# Altium schematic sheet 1.5KW总控制板新.SchDoc
size A2; PageSetup: Record=PageOptions|CenterHorizontal=True|CenterVertical=True|PrintScale=0.50|XCorrection=1.00|YCorrection=1.00|PrintKind=1|BorderSize=5000000|LeftOffset=0|BottomOffset=0|Orientation=2|PaperLength=1000|PaperWidth=1000|Scale=100|PaperSource=15|PrintQuality=600|MediaType=1|DitherType=10|PaperKind=A3|PrintScaleMode=1
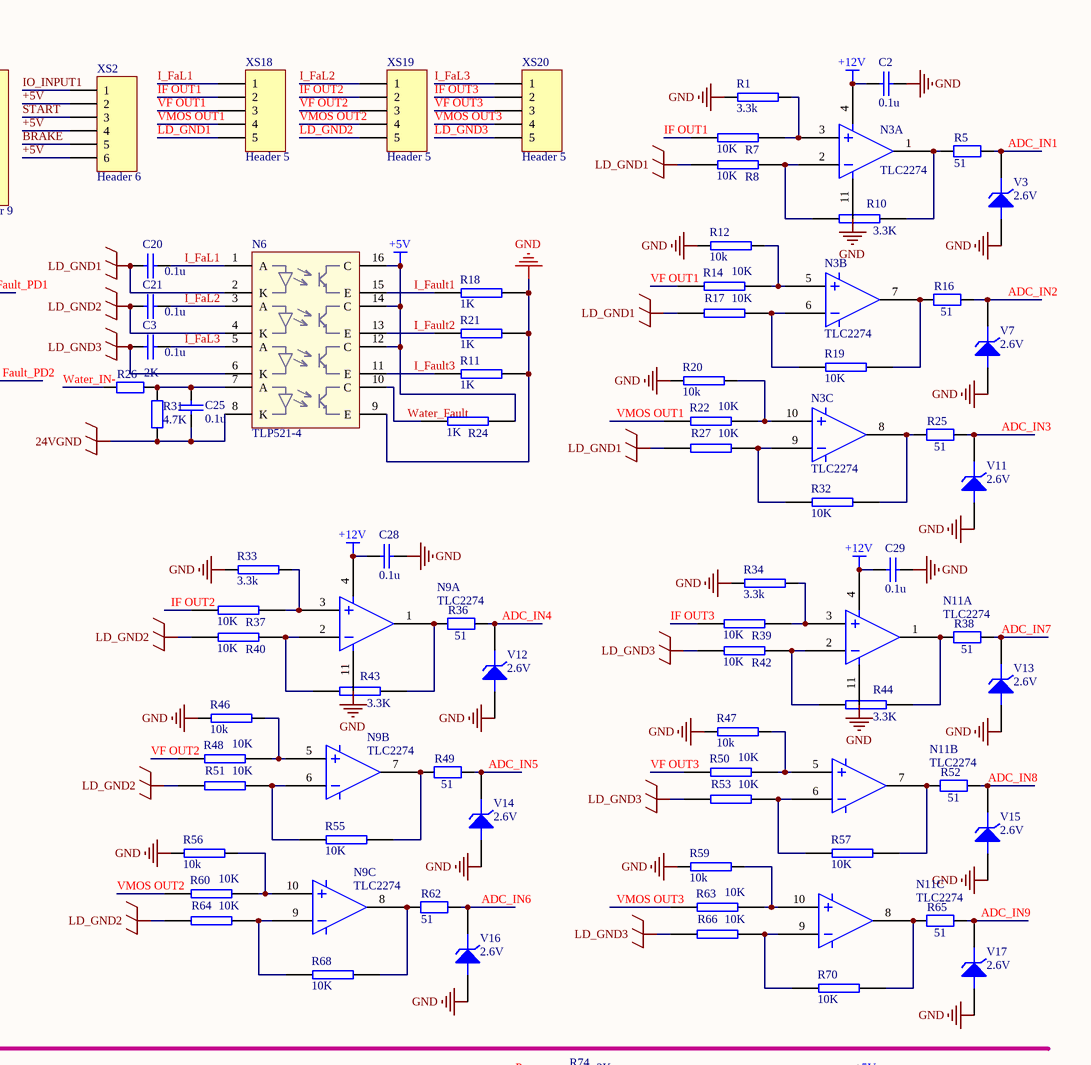
[diagram p0: 1.5KW总控制板新.SchDoc, top right]
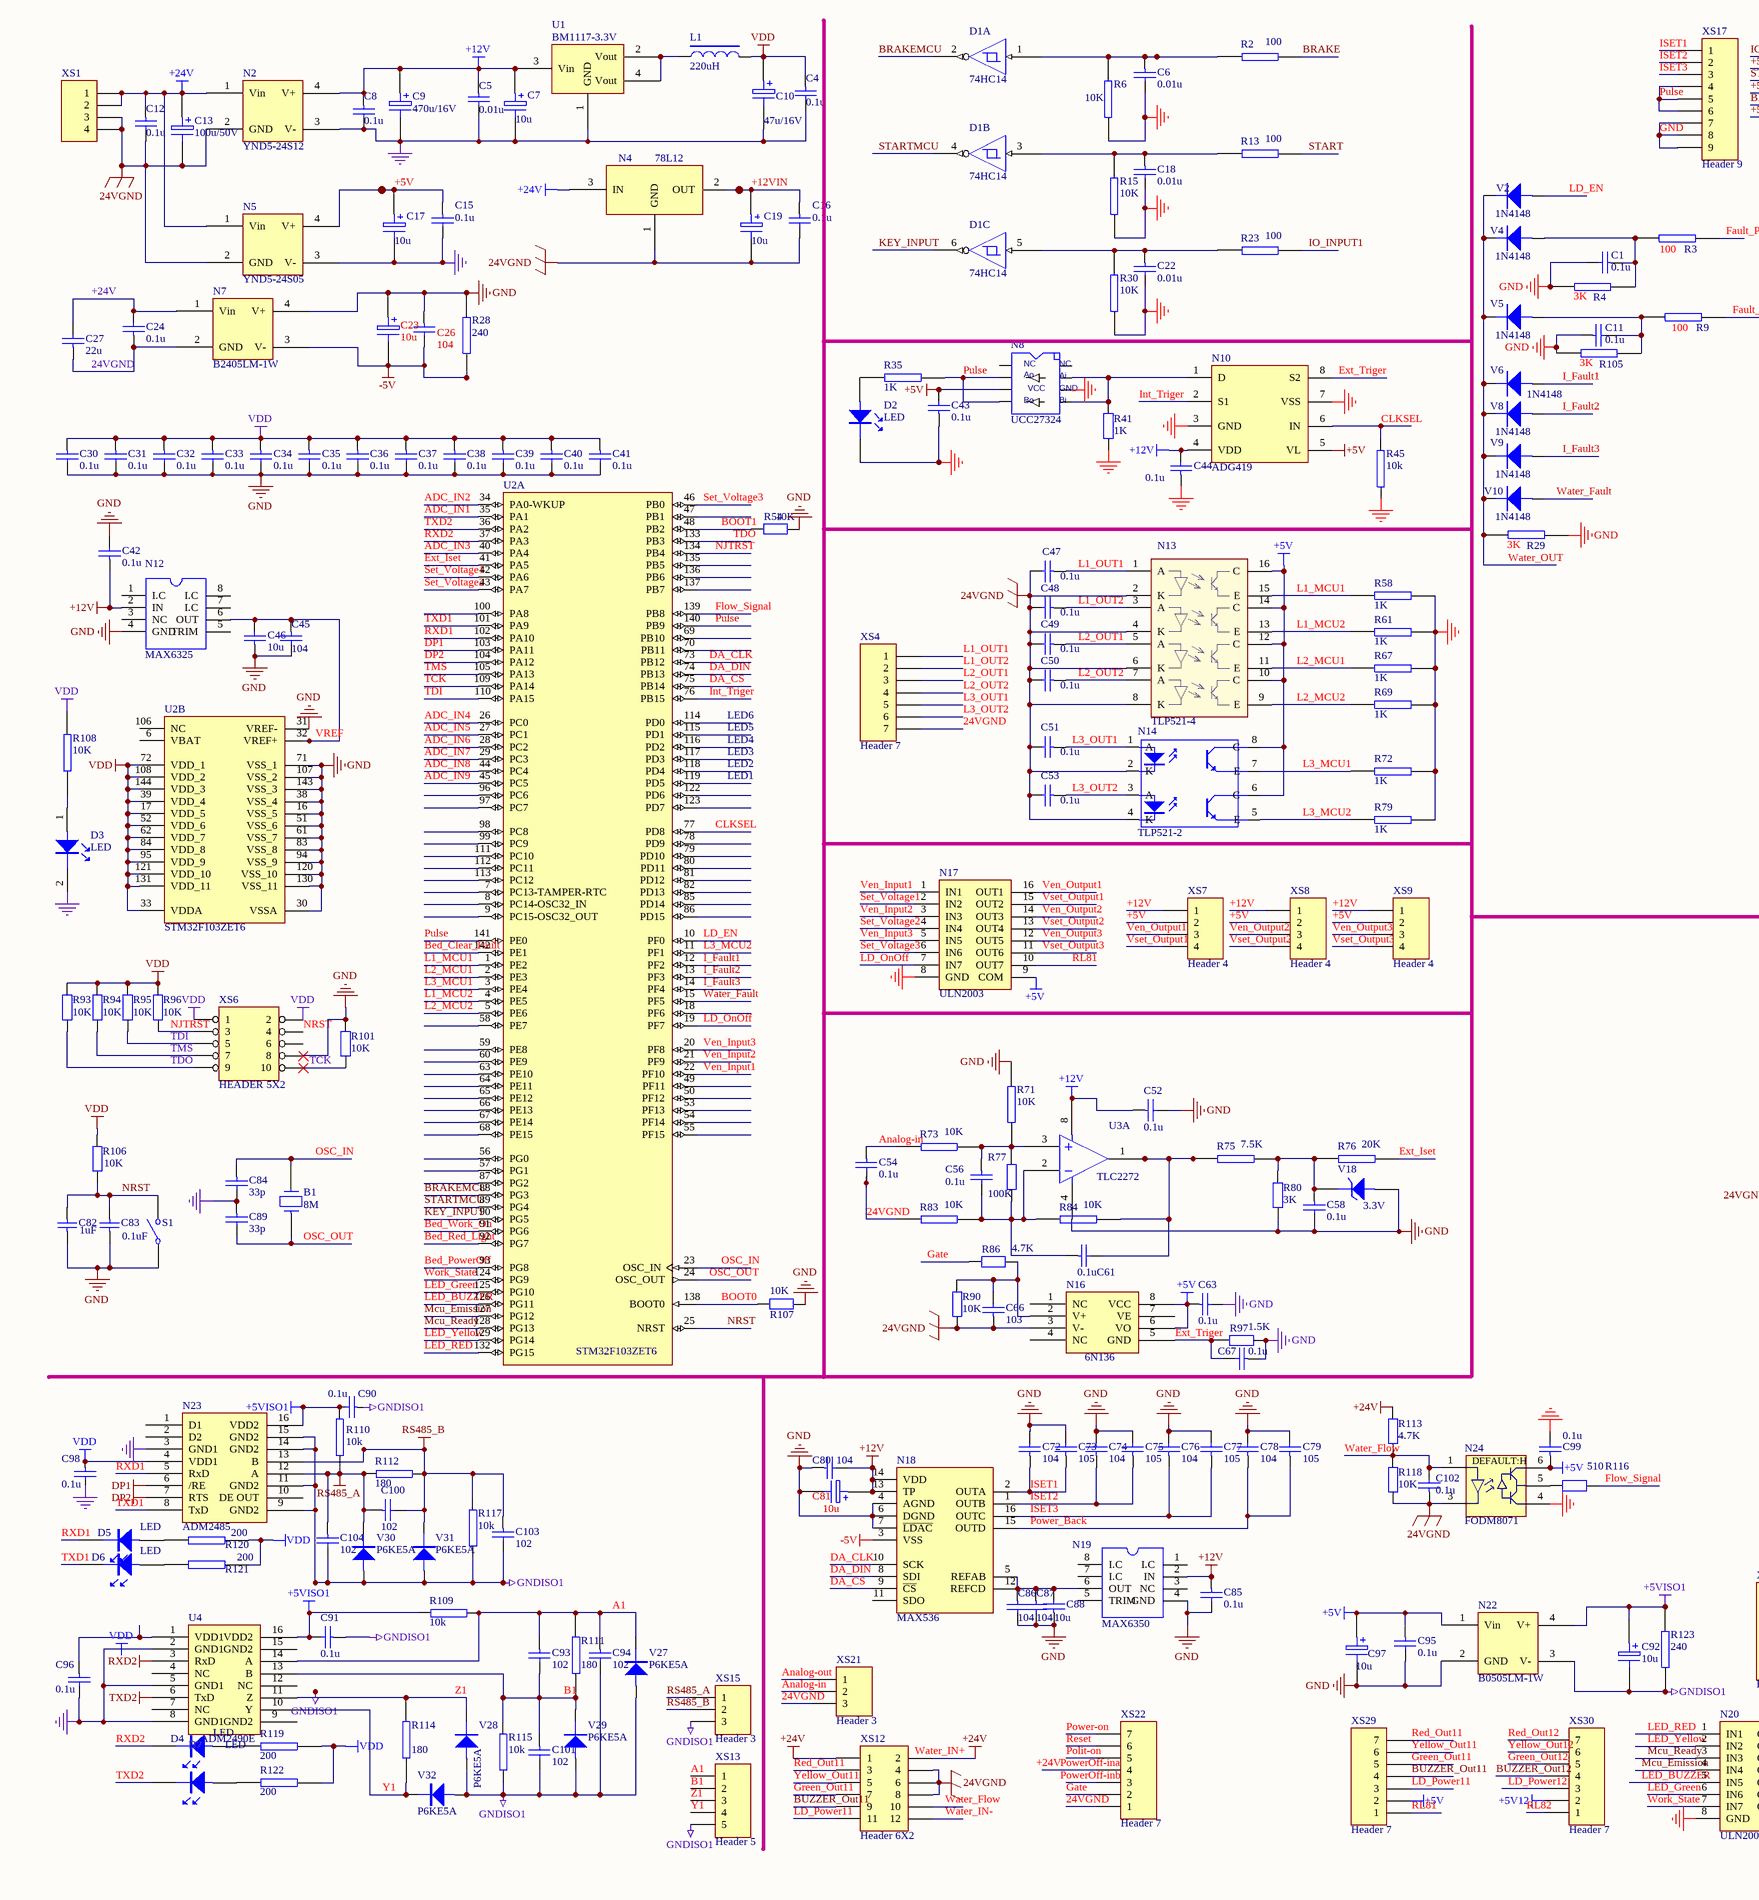
[diagram p1: 1.5KW总控制板新.SchDoc, bottom left]
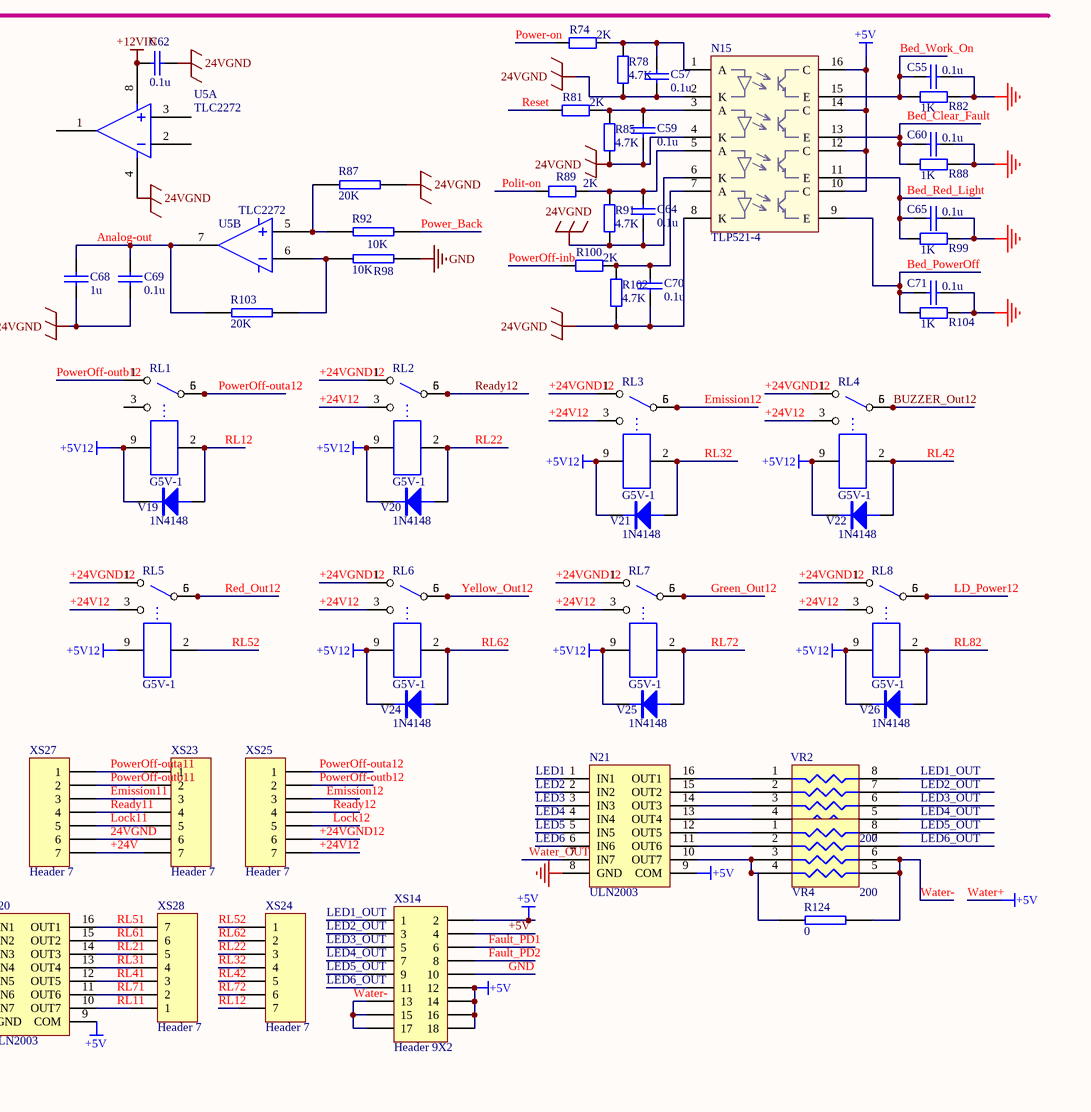
[diagram p2: 1.5KW总控制板新.SchDoc, bottom right]

## Parts
B1  8M  [CRY_SMB]
C1  0.1u  [0805]
C2  0.1u  [0805]
C3  0.1u  [0805]
C4  0.1u  [0805]
C5  0.01u  [0805]
C6  0.01u  [0805]
C7  10u  [1206]
C8  0.1u  [0805]
C9  470u/16V  [3008]
C10  47u/16V  [1206]
C11  0.1u  [0805]
C12  0.1u  [0805]
C13  100u/50V  [CD5-8]
C15  0.1u  [0805]
C16  0.1u  [0805]
C17  10u  [1206]
C18  0.01u  [0805]
C19  10u  [1206]
C20  0.1u  [0805]
C21  0.1u  [0805]
C22  0.01u  [0805]
C23  10u  [1206]
C24  0.1u  [0805]
C25  0.1u  [0805]
C26  104  [0805]
C27  22u  [1206]
C28  0.1u  [0805]
C29  0.1u  [0805]
C30  0.1u  [0805]
C31  0.1u  [0805]
C32  0.1u  [0805]
C33  0.1u  [0805]
C34  0.1u  [0805]
C35  0.1u  [0805]
C36  0.1u  [0805]
C37  0.1u  [0805]
C38  0.1u  [0805]
C39  0.1u  [0805]
C40  0.1u  [0805]
C41  0.1u  [0805]
C42  0.1u  [0805]
C43  0.1u  [0805]
C44  0.1u  [0805]
C45  104  [0805]
C46  10u  [0805]
C47  0.1u  [0805]
C48  0.1u  [0805]
C49  0.1u  [0805]
C50  0.1u  [0805]
C51  0.1u  [0805]
C52  0.1u  [0805]
C53  0.1u  [0805]
C54  0.1u  [0805]
C55  0.1u  [0805]
C56  0.1u  [0805]
C57  0.1u  [0805]
C58  0.1u  [0805]
C59  0.1u  [0805]
C60  0.1u  [0805]
C61  0.1u  [0805]
C62  0.1u  [0805]
C63  0.1u  [0805]
C64  0.1u  [0805]
C65  0.1u  [0805]
C66  103  [0805]
C67  0.1u  [0805]
C68  1u  [0805]
C69  0.1u  [0805]
C70  0.1u  [0805]
C71  0.1u  [0805]
C72  104  [0805]
C73  105  [0805]
C74  104  [0805]
C75  105  [0805]
C76  104  [0805]
C77  105  [0805]
C78  104  [0805]
C79  105  [0805]
C80  104  [0805]
C81  10u  [1206]
C82  1uF  [0805]
C83  0.1uF  [0805]
C84  33p  [0805]
C85  0.1u  [0805]
C86  104  [0805]
C87  104  [0805]
C88  10u  [0805]
C89  33p  [0805]
C90  0.1u  [0805]
C91  0.1u  [0805]
C92  10u  [1206]
C93  102  [0805]
C94  102  [0805]
C95  0.1u  [0805]
C96  0.1u  [0805]
C97  10u  [1206]
C98  0.1u  [0805]
C99  0.1u  [0805]
C100  102  [0805]
C101  102  [0805]
C102  0.1u  [0805]
C103  102  [0805]
C104  102  [0805]
D1  74HC14  [SO-14]  (parts A,B,C of 6)
D2  LED  [1206A]
D3  LED  [1206A]
D4  LED  [1206A]
D5  LED  [1206A]
D6  LED  [1206A]
D7  LED  [1206A]
L1  220uH  [1812]
N2  YND5-24S12  [YND5]
N3  TLC2274  [SO-14]  (parts A,B,C of 4)
N4  78L12  [TO-92_2]
N5  YND5-24S05  [YND5]
N6  TLP521-4  [ILEAD-16]
N7  B2405LM-1W  [B0505LM]
N8  UCC27324  [SO-8]
N9  TLC2274  [SO-14]  (parts A,B,C of 4)
N10  ADG419  [SO-8]
N11  TLC2274  [SO-14]  (parts A,B,C of 4)
N12  MAX6325  [SO-8]
N13  TLP521-4  [ILEAD-16]
N14  TLP521-2  [ILEAD-8]
N15  TLP521-4  [ILEAD-16]
N16  6N136  [ILEAD-8]
N17  ULN2003  [SOIC127P600-16N]
N18  MAX536  [SOIC-16]
N19  MAX6350  [SO-8]
N20  ULN2003  [SOIC127P600-16N]
N21  ULN2003  [SOIC127P600-16N]
N22  B0505LM-1W  [B0505LM]
N23  ADM2485  [SOIC-16]
N24  FODM8071  [SOP5]
R1  3.3k  [0805]
R2  100  [0805]
R3  100  [0805]
R4  3K  [0805]
R5  51  [0805]
R6  10K  [0805]
R7  10K  [0805]
R8  10K  [0805]
R9  100  [0805]
R10  3.3K  [0805]
R11  1K  [0805]
R12  10k  [0805]
R13  100  [0805]
R14  10K  [0805]
R15  10K  [0805]
R16  51  [0805]
R17  10K  [0805]
R18  1K  [0805]
R19  10K  [0805]
R20  10k  [0805]
R21  1K  [0805]
R22  10K  [0805]
R23  100  [0805]
R24  1K  [0805]
R25  51  [0805]
R26  2K  [0805]
R27  10K  [0805]
R28  240  [1206]
R29  3K  [0805]
R30  10K  [0805]
R31  4.7K  [0805]
R32  10K  [0805]
R33  3.3k  [0805]
R34  3.3k  [0805]
R35  1K  [0805]
R36  51  [0805]
R37  10K  [0805]
R38  51  [0805]
R39  10K  [0805]
R40  10K  [0805]
R41  1K  [0805]
R42  10K  [0805]
R43  3.3K  [0805]
R44  3.3K  [0805]
R45  10k  [0805]
R46  10k  [0805]
R47  10k  [0805]
R48  10K  [0805]
R49  51  [0805]
R50  10K  [0805]
R51  10K  [0805]
R52  51  [0805]
R53  10K  [0805]
R54  10K  [0805]
R55  10K  [0805]
R56  10k  [0805]
R57  10K  [0805]
R58  1K  [0805]
R59  10k  [0805]
R60  10K  [0805]
R61  1K  [0805]
R62  51  [0805]
R63  10K  [0805]
R64  10K  [0805]
R65  51  [0805]
R66  10K  [0805]
R67  1K  [0805]
R68  10K  [0805]
R69  1K  [0805]
R70  10K  [0805]
R71  10K  [0805]
R72  1K  [0805]
R73  10K  [0805]
R74  2K  [0805]
R75  7.5K  [0805]
R76  20K  [0805]
R77  100K  [0805]
R78  4.7K  [0805]
R79  1K  [0805]
R80  3K  [0805]
R81  2K  [0805]
R82  1K  [0805]
R83  10K  [0805]
R84  10K  [0805]
R85  4.7K  [0805]
R86  4.7K  [1206]
R87  20K  [0805]
R88  1K  [0805]
R89  2K  [0805]
R90  10K  [0805]
R91  4.7K  [0805]
R92  10K  [0805]
R93  10K  [0805]
R94  10K  [0805]
R95  10K  [0805]
R96  10K  [0805]
R97  1.5K  [0805]
R98  10K  [0805]
R99  1K  [0805]
R100  2K  [0805]
R101  10K  [0805]
R102  4.7K  [0805]
R103  20K  [0805]
R104  1K  [0805]
R105  3K  [0805]
R106  10K  [0805]
R107  10K  [0805]
R108  10K  [0805]
R109  10k  [0805]
R110  10k  [0805]
R111  180  [1206]
R112  180  [1206]
R113  4.7K  [0805]
R114  180  [1206]
R115  10k  [0805]
R116  510  [0805]
R117  10k  [0805]
R118  10K  [0805]
R119  200  [0805]
R120  200  [0805]
R121  200  [0805]
R122  200  [0805]
R123  240  [1206]
R124  0  [0805]
RL1  G5V-1  [G5V-1]
RL2  G5V-1  [G5V-1]
RL3  G5V-1  [G5V-1]
RL4  G5V-1  [G5V-1]
RL5  G5V-1  [G5V-1]
RL6  G5V-1  [G5V-1]
RL7  G5V-1  [G5V-1]
RL8  G5V-1  [G5V-1]
S1  SW-SPST  [KEY_3*6*2.5]  (value not drawn)
U1  BM1117-3.3V  [SOT-223]
U2  STM32F103ZET6  [LQFP144_N]  (parts A,B of 2)
U3  TLC2272  [SO-8]  (part A of 2)
U4  ADM2490E  [SOIC-16]
U5  TLC2272  [SO-8]  (parts A,B of 2)
V2  1N4148  [1206A]
V3  2.6V  [1206A]
V4  1N4148  [1206A]
V5  1N4148  [1206A]
V6  1N4148  [1206A]
V7  2.6V  [1206A]
V8  1N4148  [1206A]
V9  1N4148  [1206A]
V10  1N4148  [1206A]
V11  2.6V  [1206A]
V12  2.6V  [1206A]
V13  2.6V  [1206A]
V14  2.6V  [1206A]
V15  2.6V  [1206A]
V16  2.6V  [1206A]
V17  2.6V  [1206A]
V18  3.3V  [1206A]
V19  1N4148  [1206A]
V20  1N4148  [1206A]
V21  1N4148  [1206A]
V22  1N4148  [1206A]
V24  1N4148  [1206A]
V25  1N4148  [1206A]
V26  1N4148  [1206A]
V27  P6KE5A  [1206-D]
V28  P6KE5A  [1206-D]
V29  P6KE5A  [1206-D]
V30  P6KE5A  [1206-D]
V31  P6KE5A  [1206-D]
V32  P6KE5A  [1206-D]
VR2  200  [MINZIP]
VR4  200  [MINZIP]
XS1  Header 4  [SIP-4]  (value not drawn)
XS2  Header 6  [SIP-6]
XS4  Header 7  [SIP-7]
XS6  HEADER 5X2  [PHD-2*5]
XS7  Header 4  [SIP-4]
XS8  Header 4  [SIP-4]
XS9  Header 4  [SIP-4]
XS12  Header 6X2  [PHD-2*6]
XS13  Header 5  [SIP-5]
XS14  Header 9X2  [PHD-2*9]
XS15  Header 3  [SIP-3]
XS17  Header 9  [SIP-9]
XS18  Header 5  [SIP-5]
XS19  Header 5  [SIP-5]
XS20  Header 5  [SIP-5]
XS21  Header 3  [sip-3]
XS22  Header 7  [sip-7]
XS23  Header 7  [sip-7]
XS24  Header 7  [HDR1X7]
XS25  Header 7  [HDR1X7]
XS27  Header 7  [HDR1X7]
XS28  Header 7  [HDR1X7]
XS29  Header 7  [HDR1X7]
XS30  Header 7  [HDR1X7]

## Nets
24VGND: C12.2 C13.2 C16.2 C19.2 C24.1 C25.1 C27.1 C47.2 C48.2 C49.2 C50.2 C51.2 C53.2 C54.2 C57.1 C59.1 C62.1 C64.1 C66.1 C68.2 C69.2 C70.1 C102.1 N2.2(GND) N4.1(GND) N5.2(GND) N6.8(K) N7.2(GND) N13.2(K) N13.4(K) N13.6(K) N13.8(K) N14.2(K) N14.4(K) N15.2(K) N15.4(K) N15.6(K) N15.8(K) N16.3(V-) N24.3(IN-) R31.2 R78.2 R83.1 R85.2 R87.1 R90.2 R91.2 R102.2 R118.2 U5.4 XS1.3 XS1.4 XS4.7 XS12.4 XS12.6 XS12.8 XS21.3 XS22.1 XS23.6 XS27.6
+5V: C15.1 C17.1 C43.2 C63.1 C95.1 C97.1 C99.1 D1.14(+5V) N5.4(V+) N6.12(C) N6.14(C) N6.16(C) N8.6(VCC) N10.5(VL) N13.10(C) N13.12(C) N13.14(C) N13.16(C) N14.6(C) N14.8(C) N15.10(C) N15.12(C) N15.14(C) N15.16(C) N16.6(VO) N16.8(VCC) N17.9(COM) N20.9(COM) N21.9(COM) N22.1(Vin) N24.6(VDD) R24.1 XS2.2 XS2.4 XS2.6 XS7.2 XS8.2 XS9.2 XS14.2 XS14.4 XS14.12 XS14.14 XS14.16 XS14.18 XS29.2  [also labelled Water+]
+5V12: RL1.9 RL2.9 RL3.9 RL4.9 RL5.9 RL6.9 RL7.9 RL8.9 V19.2(K) V20.2(K) V21.2(K) V22.2(K) V24.2(K) V25.2(K) V26.2(K) XS30.2
+5VISO1: C90.2 C91.2 C92.1 N22.4(V+) N23.16(VDD2) R109.1 R110.1 R123.2 U4.16(VDD2)
+12V: C2.1 C5.1 C7.1 C8.1 C9.1 C28.1 C29.1 C42.1 C44.2 C52.1 C80.2 C81.1 C85.1 N2.4(V+) N3.4 N9.4 N10.4(VDD) N11.4 N12.2(IN) N18.13(TP) N18.14(VDD) N19.2(IN) U1.3(Vin) U3.8 XS7.1 XS8.1 XS9.1
+12VIN: C16.1 C19.1 C62.2 N4.2(OUT) U5.8
+24V: C12.1 C13.1 C24.2 C27.2 N2.1(Vin) N4.3(IN) N5.1(Vin) N7.1(Vin) R113.2 XS1.1 XS1.2 XS12.1 XS12.2 XS23.7 XS27.7
-5V: C23.2 C26.2 N7.3(V-) N18.3(VSS) R28.1
DP1: N23.6(/RE) U2.103(PA11)
DP2: N23.7(RTS) U2.104(PA12)
GND: C1.2 C2.2 C4.2 C5.2 C6.2 C7.2 C8.2 C9.2 C10.2 C11.1 C15.2 C17.2 C18.2 C22.2 C23.1 C26.1 C28.2 C29.2 C30.2 C31.2 C32.2 C33.2 C34.2 C35.2 C36.2 C37.2 C38.2 C39.2 C40.2 C41.2 C42.2 C43.1 C44.1 C45.2 C46.1 C52.2 C55.1 C58.2 C60.1 C63.2 C65.1 C67.1 C71.1 C72.2 C73.2 C74.2 C75.2 C76.2 C77.2 C78.2 C79.2 C80.1 C81.2 C82.1 C83.1 C84.2 C85.2 C86.2 C87.2 C88.1 C89.1 C95.2 C96.2 C97.2 C98.2 C99.2 D1.7(GND) D2.2 D3.2 N2.3(V-) N3.11 N5.3(V-) N6.9(E) N7.4(V+) N8.3(GND) N9.11 N10.3(GND) N10.7(VSS) N11.11 N12.4(GND) N17.8(GND) N18.4(AGND) N18.6(DGND) N18.7(~{LDAC}) N19.4(GND) N20.8(GND) N21.8(GND) N22.2(GND) N23.3(GND1) N24.4(GND) R1.2 R4.1 R6.1 R11.2 R12.2 R15.1 R18.2 R20.2 R21.2 R28.2 R29.1 R30.1 R33.2 R34.2 R41.2 R45.1 R46.2 R47.2 R54.1 R56.2 R58.2 R59.2 R61.2 R67.2 R69.2 R71.2 R72.2 R79.2 R80.2 R82.2 R88.2 R97.2 R98.1 R99.2 R101.1 R104.2 R105.2 R107.1 S1.1(COMMON) U1.1(GND) U2.16(VSS_5) U2.30(VSSA) U2.31(VREF-) U2.38(VSS_4) U2.51(VSS_6) U2.61(VSS_7) U2.71(VSS_1) U2.83(VSS_8) U2.94(VSS_9) U2.107(VSS_2) U2.120(VSS_10) U2.130(VSS_11) U2.143(VSS_3) U3.4 U4.2(GND1) U4.5(GND1) U4.8(GND1) V3.1(A) V7.1(A) V11.1(A) V12.1(A) V13.1(A) V14.1(A) V15.1(A) V16.1(A) V17.1(A) V18.1(A) XS6.8 XS14.10 XS17.7 XS17.8 XS17.9
GNDISO1: C90.1 C91.1 C92.2 C94.2 C101.2 C103.2 C104.2 N22.3(V-) N23.9(GND2) N23.11(GND2) N23.14(GND2) N23.15(GND2) R115.2 R117.2 R123.1 V27.A V28.A V29.A V30.A V31.A V32.A XS13.5 XS15.3
LD_GND1: C20.2 N6.2(K) R8.1 R17.1 R27.1 XS18.5
LD_GND2: C21.1 N6.4(K) R40.1 R51.1 R64.1 XS19.5
LD_GND3: C3.1 N6.6(K) R42.1 R53.1 R66.1 XS20.5
RS485_A: C100.1 C104.1 N23.12(A) R110.2 R112.1 V30.K XS15.1
RS485_B: C100.2 C103.1 N23.13(B) R112.2 R117.1 V31.K XS15.2
RXD2: D4.2 U2.37(PA3) U4.3(RxD)
TXD2: D7.2 U2.36(PA2) U4.6(TxD)
VDD: C4.1 C10.1 C30.1 C31.1 C32.1 C33.1 C34.1 C35.1 C36.1 C37.1 C38.1 C39.1 C40.1 C41.1 C98.1 L1.2 N23.4(VDD1) R93.1 R94.1 R95.1 R96.1 R106.2 R108.1 R119.2 R120.2 R121.2 R122.2 U2.17(VDD_5) U2.33(VDDA) U2.39(VDD_4) U2.52(VDD_6) U2.62(VDD_7) U2.72(VDD_1) U2.84(VDD_8) U2.95(VDD_9) U2.108(VDD_2) U2.121(VDD_10) U2.131(VDD_11) U2.144(VDD_3) XS6.1 XS6.2
+24V12: RL2.3 RL3.3 RL4.3 RL5.3 RL6.3 RL7.3 RL8.3 XS25.7
+24VGND12: RL2.1 RL3.1 RL4.1 RL5.1 RL6.1 RL7.1 RL8.1 XS25.6
A1: C93.1 C94.1 R109.2 R111.1 U4.14(A) V27.K XS13.1
ADC_IN1: R5.1 U2.35(PA1) V3.2(K)
ADC_IN2: R16.1 U2.34(PA0-WKUP) V7.2(K)
ADC_IN3: R25.1 U2.40(PA4) V11.2(K)
ADC_IN4: R36.1 U2.26(PC0) V12.2(K)
ADC_IN5: R49.1 U2.27(PC1) V14.2(K)
ADC_IN6: R62.1 U2.28(PC2) V16.2(K)
ADC_IN7: R38.1 U2.29(PC3) V13.2(K)
ADC_IN8: R52.1 U2.44(PC4) V15.2(K)
ADC_IN9: R65.1 U2.45(PC5) V17.2(K)
Analog-in: C54.1 R73.1 XS21.2
Analog-out: C68.1 C69.1 R103.2 U5.7 XS21.1
B1: C93.2 C101.1 R111.2 R115.1 U4.13(B) V29.K XS13.2
Bed_Clear_Fault: C60.2 N15.13(E) R88.1 U2.142(PE1)
Bed_PowerOff: C71.2 N15.9(E) R104.1 U2.93(PG8)
Bed_Red_Light: C65.2 N15.11(E) R99.1 U2.92(PG7)
Bed_Work_On: C55.2 N15.15(E) R82.1 U2.91(PG6)
BOOT0: R107.2 U2.138(BOOT0)
BOOT1: R54.2 U2.48(PB2)
BRAKE: R2.2 XS2.5
BRAKEMCU: D1.2 U2.88(PG3)
BUZZER_Out11: XS12.9 XS29.4
BUZZER_Out12: RL4.5 RL4.6 XS30.4
CLKSEL: N10.6(IN) R45.2 U2.77(PD8)
DA_CLK: N18.10(SCK) U2.73(PB12)
DA_CS: N18.9(~{CS}) U2.75(PB14)
DA_DIN: N18.8(SDI) U2.74(PB13)
Emission11: XS23.3 XS27.3
Emission12: RL3.5 RL3.6 XS25.3
Ext_Iset: R76.2 U2.41(PA5)
Ext_Triger: C67.2 N10.8(S2) N16.5(GND) R97.1
Fault_PD1: R3.2 XS14.6
Fault_PD2: R9.2 XS14.8
Flow_Signal: R116.1 U2.139(PB8)
Gate: R86.2 XS22.2
Green_Out11: XS12.7 XS29.5
Green_Out12: RL7.5 RL7.6 XS30.5
I_FaL1: C20.1 N6.1(A) XS18.1
I_FaL2: C21.2 N6.3(A) XS19.1
I_FaL3: C3.2 N6.5(A) XS20.1
I_Fault1: N6.15(E) R18.1 U2.12(PF2) V6.1(A)
I_Fault2: N6.13(E) R21.1 U2.13(PF3) V8.1(A)
I_Fault3: N6.11(E) R11.1 U2.14(PF4) V9.1(A)
IF OUT1: R7.1 XS18.2
IF OUT2: R37.1 XS19.2
IF OUT3: R39.1 XS20.2
Int_Triger: N10.2(S1) U2.76(PB15)
IO_INPUT1: R23.2 XS2.1
ISET1: C72.1 C73.1 N18.2(OUTA) XS17.1
ISET2: C74.1 C75.1 N18.1(OUTB) XS17.2
ISET3: C76.1 C77.1 N18.16(OUTC) XS17.3
KEY_INPUT: D1.6 U2.90(PG5)
L1_MCU1: N13.15(E) R58.1 U2.1(PE2)
L1_MCU2: N13.13(E) R61.1 U2.4(PE5)
L1_OUT1: C47.1 N13.1(A) XS4.1
L1_OUT2: C48.1 N13.3(A) XS4.2
L2_MCU1: N13.11(E) R67.1 U2.2(PE3)
L2_MCU2: N13.9(E) R69.1 U2.5(PE6)
L2_OUT1: C49.1 N13.5(A) XS4.3
L2_OUT2: C50.1 N13.7(A) XS4.4
L3_MCU1: N14.7(E) R72.1 U2.3(PE4)
L3_MCU2: N14.5(E) R79.1 U2.11(PF1)
L3_OUT1: C51.1 N14.1(A) XS4.5
L3_OUT2: C53.1 N14.3(A) XS4.6
LD_EN: U2.10(PF0) V2.1(A)
LD_OnOff: N17.7(IN7) U2.19(PF7)
LD_Power11: XS12.11 XS29.3
LD_Power12: RL8.5 RL8.6 XS30.3
LED1: N21.1(IN1) U2.119(PD5)
LED1_OUT: VR2.8 XS14.1
LED2: N21.2(IN2) U2.118(PD4)
LED2_OUT: VR2.7 XS14.3
LED3: N21.3(IN3) U2.117(PD3)
LED3_OUT: VR2.6 XS14.5
LED4: N21.4(IN4) U2.116(PD2)
LED4_OUT: VR2.5 XS14.7
LED5: N21.5(IN5) U2.115(PD1)
LED5_OUT: VR4.8 XS14.9
LED6: N21.6(IN6) U2.114(PD0)
LED6_OUT: VR4.7 XS14.11
LED_BUZZER: N20.5(IN5) U2.126(PG11)
LED_Green: N20.6(IN6) U2.125(PG10)
LED_RED: N20.1(IN1) U2.132(PG15)
LED_Yellow: N20.2(IN2) U2.129(PG14)
Lock11: XS23.5 XS27.5
Lock12: XS25.5
Mcu_Emission: N20.4(IN4) U2.127(PG12)
Mcu_Ready: N20.3(IN3) U2.128(PG13)
NJTRST: R96.2 U2.134(PB4) XS6.3
NRST: C82.2 C83.2 R106.1 S1.2(NO) U2.25(NRST) XS6.4
OSC_IN: B1.2 C84.1 U2.23(OSC_IN)
OSC_OUT: B1.1 C89.2 U2.24(OSC_OUT)
Polit-on: R89.2 XS22.5
Power-on: R74.2 XS22.7
Power_Back: C78.1 C79.1 N18.15(OUTD) R92.1
PowerOff-ina: XS22.4
PowerOff-inb: R100.2
PowerOff-outa11: XS23.1 XS27.1
PowerOff-outa12: RL1.5 RL1.6 XS25.1
PowerOff-outb11: XS23.2 XS27.2
PowerOff-outb12: RL1.1 XS25.2
Pulse: N8.5(Bout) N8.7(Aout) R35.2 U2.140(PB9) U2.141(PE0) XS17.4 XS17.5 XS17.6
Ready11: XS23.4 XS27.4
Ready12: RL2.5 RL2.6 XS25.4
Red_Out11: XS12.3 XS29.7
Red_Out12: RL5.5 RL5.6 XS30.7
Reset: R81.2 XS22.6
RL11: N20.10(OUT7) XS28.1
RL12: RL1.2 V19.1(A) XS24.7
RL21: N20.14(OUT3) XS28.5
RL22: RL2.2 V20.1(A) XS24.3
RL31: N20.13(OUT4) XS28.4
RL32: RL3.2 V21.1(A) XS24.4
RL41: N20.12(OUT5) XS28.3
RL42: RL4.2 V22.1(A) XS24.5
RL51: N20.16(OUT1) XS28.7
RL52: RL5.2 XS24.1
RL61: N20.15(OUT2) XS28.6
RL62: RL6.2 V24.1(A) XS24.2
RL71: N20.11(OUT6) XS28.2
RL72: RL7.2 V25.1(A) XS24.6
RL81: N17.10(OUT7) XS29.1
RL82: RL8.2 V26.1(A) XS30.1
RXD1: D5.2 N23.5(RxD) U2.102(PA10)
Set_Voltage1: N17.2(IN2) U2.42(PA6)
Set_Voltage2: N17.4(IN4) U2.43(PA7)
Set_Voltage3: N17.6(IN6) U2.46(PB0)
START: R13.2 XS2.3
STARTMCU: D1.4 U2.89(PG4)
TCK: R101.2 U2.109(PA14) XS6.10
TDI: R95.2 U2.110(PA15) XS6.5
TDO: R93.2 U2.133(PB3) XS6.9
TMS: R94.2 U2.105(PA13) XS6.7
TXD1: D6.2 N23.8(TxD) U2.101(PA9)
Ven_Input1: N17.1(IN1) U2.22(PF10)
Ven_Input2: N17.3(IN3) U2.21(PF9)
Ven_Input3: N17.5(IN5) U2.20(PF8)
Ven_Output1: N17.16(OUT1) XS7.3
Ven_Output2: N17.14(OUT3) XS8.3
Ven_Output3: N17.12(OUT5) XS9.3
VF OUT1: R14.1 XS18.3
VF OUT2: R48.1 XS19.3
VF OUT3: R50.1 XS20.3
VMOS OUT1: R22.1 XS18.4
VMOS OUT2: R60.1 XS19.4
VMOS OUT3: R63.1 XS20.4
VREF: C45.1 C46.2 N12.6(OUT) U2.32(VREF+)
Vset_Output1: N17.15(OUT2) XS7.4
Vset_Output2: N17.13(OUT4) XS8.4
Vset_Output3: N17.11(OUT6) XS9.4
Water-: R124.1 VR4.5 VR4.6 XS14.13 XS14.15 XS14.17
Water_Fault: N6.10(C) R24.2 U2.15(PF5) V10.1(A)
Water_Flow: C102.2 N24.1(IN+) R113.1 R118.1 XS12.10
Water_IN-: R26.2 XS12.12
Water_OUT: N21.7(IN7) R29.2 V2.2(K) V4.2(K) V5.2(K) V6.2(K) V8.2(K) V9.2(K) V10.2(K)
Work_State: N20.7(IN7) U2.124(PG9)
Y1: R114.2 U4.10(Y) V32.K XS13.4
Yellow_Out11: XS12.5 XS29.6
Yellow_Out12: RL6.5 RL6.6 XS30.6
Z1: R114.1 U4.11(Z) V28.K XS13.3
NetC1_1: C1.1 R3.1 R4.2 V4.1(A)
NetC6_1: C6.1 D1.1 R2.1 R6.2
NetC11_2: C11.2 R9.1 R105.1 V5.1(A)
NetC18_1: C18.1 D1.3 R13.1 R15.2
NetC22_1: C22.1 D1.5 R23.1 R30.2
NetC25_2: C25.2 N6.7(A) R26.1 R31.1
NetC56_1: C56.1 R71.1 R73.2 R77.2 U3.3
NetC56_2: C56.2 C61.1 R77.1 R83.2 R84.1 U3.2
NetC57_2: C57.2 N15.1(A) R74.1 R78.1
NetC58_1: C58.1 R75.2 R76.1 R80.1 V18.2(K)
NetC59_2: C59.2 N15.3(A) R81.1 R85.1
NetC61_2: C61.2 R75.1 R84.2 U3.1
NetC64_2: C64.2 N15.5(A) R89.1 R91.1
NetC66_2: C66.2 N16.2(V+) R86.1 R90.1
NetC70_2: C70.2 N15.7(A) R100.1 R102.1
NetC86_1: C86.1 C87.1 C88.2 N18.5(REFAB) N18.12(REFCD) N19.6(OUT)
NetC96_1: C96.1 U4.1(VDD1)
NetD2_1: D2.1 R35.1
NetD3_1: D3.1 R108.2
NetD4_1: D4.1 R119.1
NetD5_1: D5.1 R120.1
NetD6_1: D6.1 R121.1
NetD7_1: D7.1 R122.1
NetL1_1: L1.1 U1.2(Vout) U1.4(Vout)
NetN3_1: N3.1 R5.2 R10.2
NetN3_2: N3.2 R8.2 R10.1
NetN3_3: N3.3 R1.1 R7.2
NetN3_5: N3.5 R12.1 R14.2
NetN3_6: N3.6 R17.2 R19.1
NetN3_7: N3.7 R16.2 R19.2
NetN3_8: N3.8 R25.2 R32.2
NetN3_9: N3.9 R27.2 R32.1
NetN3_10: N3.10 R20.1 R22.2
NetN8_2: N8.2(Ain) N8.4(Bin) N10.1(D) R41.1
NetN9_1: N9.1 R36.2 R43.2
NetN9_2: N9.2 R40.2 R43.1
NetN9_3: N9.3 R33.1 R37.2
NetN9_5: N9.5 R46.1 R48.2
NetN9_6: N9.6 R51.2 R55.1
NetN9_7: N9.7 R49.2 R55.2
NetN9_8: N9.8 R62.2 R68.2
NetN9_9: N9.9 R64.2 R68.1
NetN9_10: N9.10 R56.1 R60.2
NetN11_1: N11.1 R38.2 R44.2
NetN11_2: N11.2 R42.2 R44.1
NetN11_3: N11.3 R34.1 R39.2
NetN11_5: N11.5 R47.1 R50.2
NetN11_6: N11.6 R53.2 R57.1
NetN11_7: N11.7 R52.2 R57.2
NetN11_8: N11.8 R65.2 R70.2
NetN11_9: N11.9 R66.2 R70.1
NetN11_10: N11.10 R59.1 R63.2
NetN21_10: N21.10(OUT7) R124.2 VR4.3 VR4.4
NetN21_11: N21.11(OUT6) VR4.2
NetN21_12: N21.12(OUT5) VR4.1
NetN21_13: N21.13(OUT4) VR2.4
NetN21_14: N21.14(OUT3) VR2.3
NetN21_15: N21.15(OUT2) VR2.2
NetN21_16: N21.16(OUT1) VR2.1
NetN24_5: N24.5(VO) R116.2
NetR87_2: R87.2 R92.2 U5.5
NetR98_2: R98.2 R103.1 U5.6

Not connected (* = marked no-connect by the designer): N8 1(NC) 8(NC); N12 1(I.C) 3(NC) 5(TRIM) 7(I.C) 8(I.C); N16 1(NC) 4(NC) 7(VE); N18 11(SDO); N19 1(I.C) 3(NC) 5(TRIM) 7(I.C) 8(I.C); N23 1(D1) 2(D2) 10(DE_OUT); N24 2(NC); RL1 3; U2 6(VBAT) 7(PC13-TAMPER-RTC) 8(PC14-OSC32_IN) 9(PC15-OSC32_OUT) 18(PF6) 47(PB1) 49(PF11) 50(PF12) 53(PF13) 54(PF14) 55(PF15) 56(PG0) 57(PG1) 58(PE7) 59(PE8) 60(PE9) 63(PE10) 64(PE11) 65(PE12) 66(PE13) 67(PE14) 68(PE15) 69(PB10) 70(PB11) 78(PD9) 79(PD10) 80(PD11) 81(PD12) 82(PD13) 85(PD14) 86(PD15) 87(PG2) 96(PC6) 97(PC7) 98(PC8) 99(PC9) 100(PA8) 106(NC) 111(PC10) 112(PC11) 113(PC12) 122(PD6) 123(PD7) 135(PB5) 136(PB6) 137(PB7); U4 4(NC) 7(NC) 9(GND2) 12(NC) 15(GND2); U5 1 2 3; XS6 6; XS22 3

## Notes on the sheet
- Labels drawn without touching a wire or pin: +24V, GNDISO1, PowerOff-inb, VDD, Water_IN+
- (in symbol FODM8071) DEFAULT:H
- (in symbol UCC27324) Ao; Ai; Bo; Bi

## Library data of the parts
B1 = CRYSTAL
C1 C11 C15 C16 C25 C42-C46 C55 C57 C59 C60 C64-C67 C70-C80 C85-C88 C90 C98 C99 C102 = CAP
C2-C6 C8 C12 C18 C20-C22 C24 C26-C41 C47-C54 C56 C58 C61-C63 C68 C69 C84 C89 C91 C93-C96 C100 C101 C103 C104 = CAP: Capacitor
C7 C9 C10 C13 C17 C19 C23 C81 C92 C97 = ELECTRO1: Electrolytic Capacitor
C82 = Cap: Capacitor; Value: 0.1uF; Published: 8-Jun-2000; LatestRevisionDate: 17-Jul-2002; LatestRevisionNote: Re-released for DXP Platform.; PackageReference: RAD-0.3; Publisher: Altium Limited; PackageDescription: Radial Cap, Thru-Hole; 2 Leads; 0.3 in Pin Spacing
C83 = Cap: Capacitor; Published: 8-Jun-2000; LatestRevisionDate: 17-Jul-2002; LatestRevisionNote: Re-released for DXP Platform.; PackageReference: RAD-0.3; Publisher: Altium Limited; PackageDescription: Radial Cap, Thru-Hole; 2 Leads; 0.3 in Pin Spacing; Value: 0.1uF
D1 = 4584
L1 = L
N2 N5 N7 N22 = B0505LM
N3 N9 N11 = LM124
N4 = VOL
N12 N19 = MAX6341
N14 = TLP521-2: Optoisolator
N16 = HCPL2601
N17 N20 N21 = ULN2003A
R1 R12 R20 R33 R34 R45-R47 R56 R59 R109 R110 R115 R117 = R
R2-R4 R6-R11 R13-R15 R17-R19 R21-R24 R27-R30 R32 R35 R37 R39 R40 R42-R44 R48 R50 R51 R53 R55 R57 R58 R60 R61 R63 R64 R66-R73 R75 R76 R79 R83 R84 R87 R92 R98 R103 R105 R108 R111 R112 R114 R119-R124 = RES2
R5 R16 R25 R26 R31 R36 R38 R49 R52 R54 R62 R65 R74 R77 R78 R80 R81 R85 R86 R89-R91 R93-R97 R100-R102 R107 R113 R116 R118 = Res2: Resistor; Value: 1K; Published: 8-Jun-2000; LatestRevisionDate: 17-Jul-2002; LatestRevisionNote: Re-released for DXP Platform.; PackageReference: AXIAL-0.4; Publisher: Altium Limited
R41 R82 R88 R99 R104 R106 = Res2: Resistor; Published: 8-Jun-2000; LatestRevisionDate: 17-Jul-2002; LatestRevisionNote: Re-released for DXP Platform.; PackageReference: AXIAL-0.4; Publisher: Altium Limited
  R41 R82 R88 R99 R104: Value: 1K
  R106: PackageDescription: Axial Device, Thru-Hole; 2 Leads; 0.4 in Pin Spacing; Value: 10K
S1 = SW-SPST: Single-Pole, Single-Throw Switch; Published: 24-Mar-1999; LatestRevisionDate: 17-Jul-2002; LatestRevisionNote: Re-released for DXP Platform.; PackageReference: SPST-2; Publisher: Altium Limited; PackageDescription: Switch; 2 Leads
U1 = BM1117
U2 = STM32F103ZET6: STM32 ARM-based 32-bit MCU Performance Line with 512 kB Flash, 64 kB Internal RAM, -40 to +85°C Temperature, 144-Pin LQFP, Tray; DatasheetVersion: rev8.0, Apr-2011; PackageVersion: 2011; PackageReference: LQFP144; PackageDescription: 144-Pin Thin Quad Flat Pack 0.5 mm Pitch; ComponentLink1Description: Manufacturer URL; ComponentLink1URL: http://www.st.com/; ComponentLink2Description: STM32F103 Datasheet; ComponentLink2URL: http://www.st.com/internet/com/TECHNICAL_RESOURCES/TECHNICAL_LITERATURE/DATASHEET/CD00191185.pdf; ComponentLink3Description: STM32 Family Web Page; ComponentLink3URL: www.st.com/stm32
U3 U5 = 1458
V2 V4-V6 V8-V10 V19-V22 V24-V26 = D
V3 V7 V11-V18 = ZENER3: Zener Diode
V27-V32 = DIODE
VR2 VR4 = RN-742: Text Field1: 50; Text Field2: 50
XS1 XS7-XS9 = Header 4: Header, 4-Pin; LatestRevisionDate: 17-Jul-2002; LatestRevisionNote: Re-released for DXP Platform.; Publisher: Altium Limited
XS2 = Header 6: Header, 6-Pin; LatestRevisionDate: 17-Jul-2002; LatestRevisionNote: Re-released for DXP Platform.; Publisher: Altium Limited
XS4 XS22-XS25 XS27-XS30 = Header 7: Header, 7-Pin; LatestRevisionDate: 17-Jul-2002; LatestRevisionNote: Re-released for DXP Platform.; Publisher: Altium Limited
XS12 = Header 6X2: Header, 6-Pin, Dual row; LatestRevisionDate: 17-Jul-2002; LatestRevisionNote: Re-released for DXP Platform.; Publisher: Altium Limited
XS13 XS18-XS20 = Header 5: Header, 5-Pin; LatestRevisionDate: 17-Jul-2002; LatestRevisionNote: Re-released for DXP Platform.; Publisher: Altium Limited
XS14 = Header 9X2: Header, 9-Pin, Dual row; LatestRevisionDate: 17-Jul-2002; LatestRevisionNote: Re-released for DXP Platform.; Publisher: Altium Limited
XS15 XS21 = Header 3: Header, 3-Pin; LatestRevisionDate: 17-Jul-2002; LatestRevisionNote: Re-released for DXP Platform.; Publisher: Altium Limited
XS17 = Header 9: Header, 9-Pin; LatestRevisionDate: 17-Jul-2002; LatestRevisionNote: Re-released for DXP Platform.; Publisher: Altium Limited